# EasyEDA Pro project Access Control Signal Relay Switch.eprj

# Schematic V2.0.1 Schematic
Create Date: 2024-05-02; Page Name: Main Page.V2.0.V2.0.1 Signal Relay Schematic; Project Name: Access Control V2.1; Schematic Name: V2.0.1 Signal Relay Schematic; Update Date: 2024-05-22; Company: RIT SHED MAKERSPACE; Drawn: Jim Heaney; Page Size: A4; Part Number: N/A; Reviewed: Jim Heaney; Version: V2.1.0
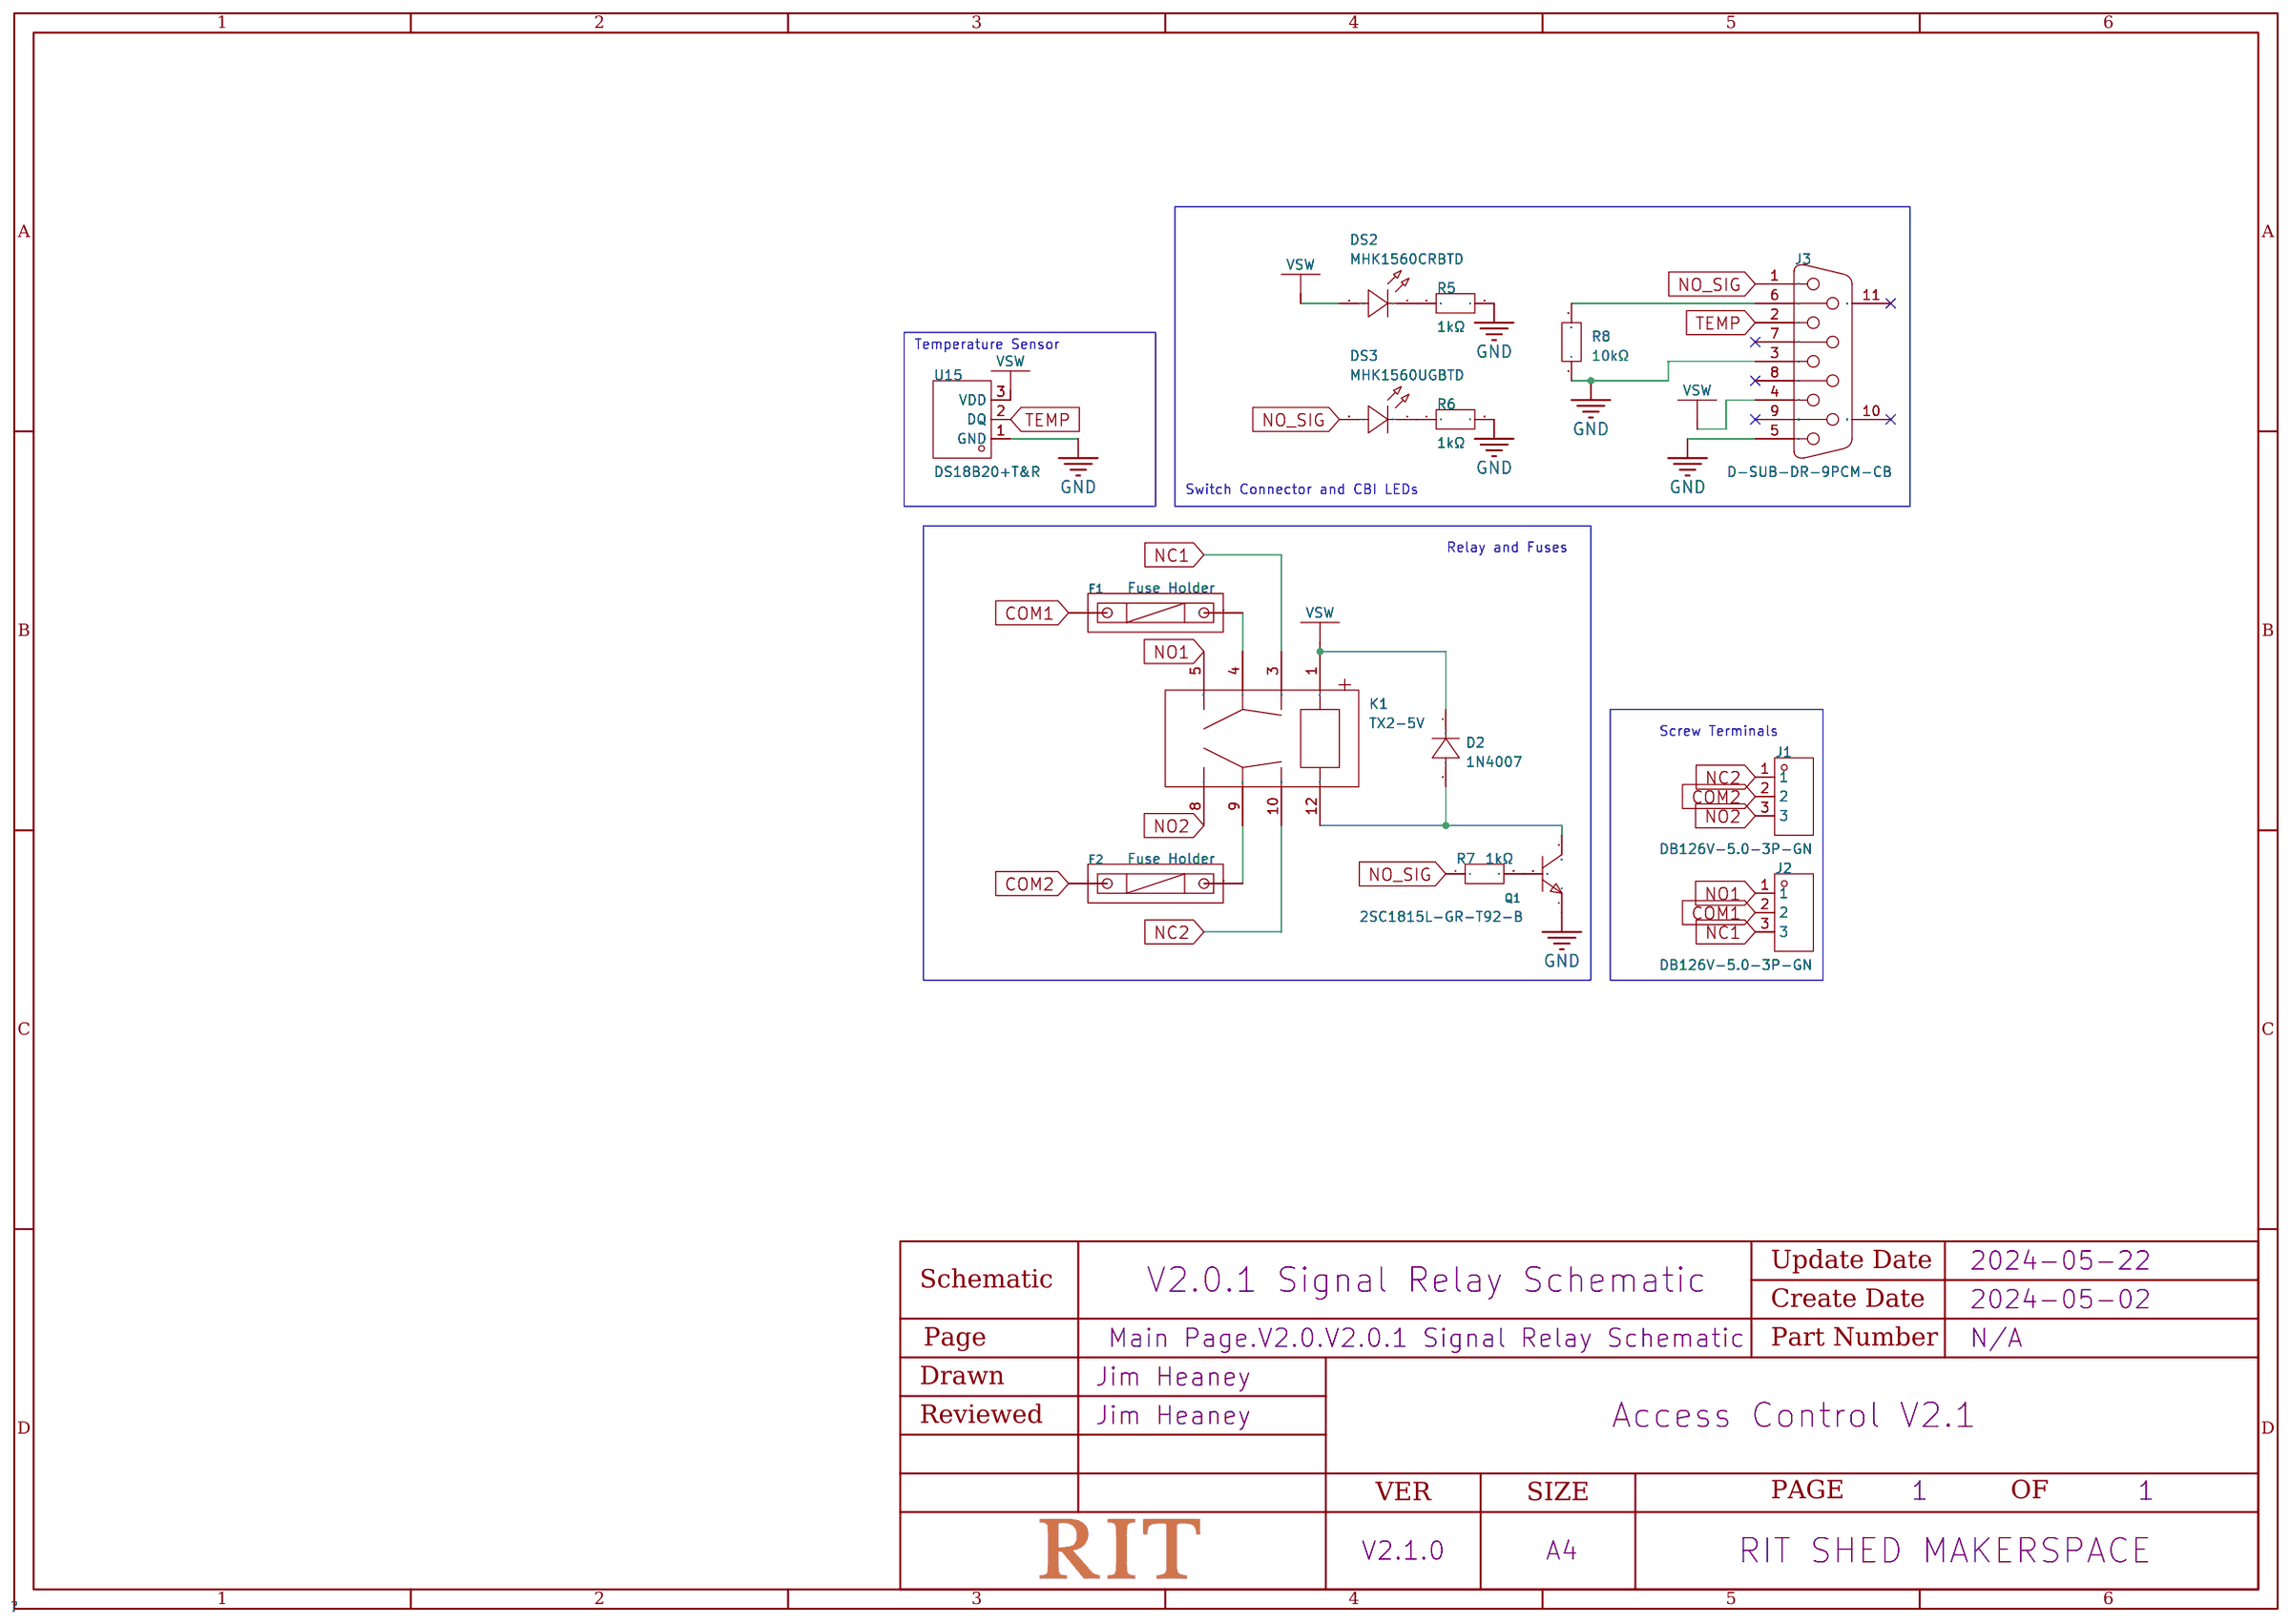
[diagram p0: schematic sheet]

## Parts
D2  1N4007  [DO-41_BD2.4-L4.7-P8.70-D0.8-RD]
DS2  MHK1560CRBTD  [LED-TH_MHK1560UGBTD]
DS3  MHK1560UGBTD  [LED-TH_MHK1560UGBTD]
F1  Fuse Holder  [FUSE-TH_L24.5-W9.8-P22.5]
F2  Fuse Holder  [FUSE-TH_L24.5-W9.8-P22.5]
J1  DB126V-5.0-3P-GN  [CONN-TH_3P-P5.00_DB126V-5.0-3P]
J2  DB126V-5.0-3P-GN  [CONN-TH_3P-P5.00_DB126V-5.0-3P]
J3  D-SUB-DR-9PCM-CB  [DB9-TH_ID09S33E4GV00LF]
K1  TX2-5V  [RELAY-TH_TX2-3V]
Q1  2SC1815L-GR-T92-B  [TO-92-3_L4.9-W3.7-P2.54-L]
R5  1kΩ  [RES-TH_BD2.3-L6.5-P10.50-D0.5]
R6  1kΩ  [RES-TH_BD2.3-L6.5-P10.50-D0.5]
R7  1kΩ  [RES-TH_BD2.3-L6.5-P10.50-D0.5]
R8  10kΩ  [RES-TH_BD2.7-L6.2-P10.20-D0.4]
U15  DS18B20+T&R  [TO-92-3_L4.9-W3.7-P2.54-L]

## Library data of the parts
D2 = 1N4007_C2985028: Forward Voltage (Vf@If):1V@1A Reverse Voltage (Vr): Average Rectified Current (Io):; LCSC Part Name: 电压:1kV 电流:1A; Supplier Part: C2985028; Manufacturer: GOODWORK(固得沃克); Supplier Footprint: DO-41; JLCPCB Part Class: Extended Part; Datasheet: https://atta.szlcsc.com/upload/public/pdf/source/20210723/C2848669_ECFE0BC1B34B7BAAA686846FF0F306A7.pdf; Supplier: LCSC; Forward Voltage (Vf@If): 1V@1A
DS2 = MHK1560CGBTD: 20mA 雾状红透镜 50mcd -40℃~+85℃ 632nm Red 85° 1.75V~2.2V Plugin,P=2.54mm Light Emitting Diodes (LED) ROHS; LCSC Part Name: 1560直插单灯翠绿色光; Supplier Part: C7470835; Manufacturer: MEIHUA(美华); Supplier Footprint: 插件,P=2.54mm; JLCPCB Part Class: Extended Part; Datasheet: https://atta.szlcsc.com/upload/public/pdf/source/20231114/0151DB1F997DCF286213A722D08B4BAA.pdf; Supplier: LCSC; Emitted Color: Emerald; Forward Voltage (VF): 1.75V~2.2V; Forward Current: 20mA; Dominant Wavelength: 520nm; Lens Color: 雾状绿透镜; Luminous Intensity: 1000mcd; Viewing Angle: 85°; Operating Temperature: -40℃~+85℃
DS3 = MHK1560UGBTD: Emitted Color:Emerald Forward Voltage (VF):1.75V~2.2V Forward Voltage (VF):1.75V~2.2V Forward Current:20mA Dominant Wavelength:520nm Dominant Wavelength:520nm Lens Color:雾状绿透镜 Luminous Intensity:1000mcd Luminous Intensity:1000mcd Viewing Angle:85° Operati; LCSC Part Name: 1560直插单灯翠绿色光; Supplier Part: C7470833; Manufacturer: MEIHUA(美华); Supplier Footprint: 插件,P=2.54mm; JLCPCB Part Class: Extended Part; Datasheet: https://atta.szlcsc.com/upload/public/pdf/source/20231114/0151DB1F997DCF286213A722D08B4BAA.pdf; Supplier: LCSC; Emitted Color: Emerald; Forward Voltage (VF): 1.75V~2.2V; Forward Current: 20mA; Dominant Wavelength: 520nm; Lens Color: 雾状绿透镜; Luminous Intensity: 1000mcd; Viewing Angle: 85°; Operating Temperature: -40℃~+85℃
F1 F2 = 保险丝透明座: Fuseholder Type:- Fuse Type:- Fuse Size:-; LCSC Part Name: 保险丝座 5*20 透明座(两件套); Supplier Part: C58066; Manufacturer: xcfuse(旭程); JLCPCB Part Class: Extended Part; Datasheet: https://atta.szlcsc.com/upload/public/pdf/source/20201109/C58066_EF84FEEE40948BE1BD26BCA72E4FE443.pdf; Supplier: LCSC
J1 J2 = DB126V-5.0-3P-GN_C395850: Structure:1x3P Pitch:5mm Color:Green Mounting Style:Straight Current Rating (Max):15A Voltage Rating (Max):250V Number of Pins:3P Number of Rows:1 Wire Gauge - AWG:14~26 Wire Gauge - AWG:14~26 Wire Gauge - mm2:1.5 Wire Gauge - mm2:1.5 Number of PINs Per R; LCSC Part Name: 5mm 1x3P 排数:1 每排P数:3 直插; Supplier Part: C395850; Manufacturer: DORABO(地博电气); Supplier Footprint: 插件,P=5mm; JLCPCB Part Class: Extended Part; Datasheet: https://atta.szlcsc.com/upload/public/pdf/source/20190923/C430579_AF9BA03CE2C1D84969AE00515C7DEF19.pdf; Supplier: LCSC; Structure: 1x3P; Pitch: 5mm; Color: Green; Mounting Style: Straight; Current Rating (Max): 15A; Voltage Rating (Max): 250V; Number of Pins: 3P; Number of Rows: 1; Wire Gauge - AWG: 14~26; Wire Gauge - mm2: 1.5; Number of PINs Per Row: 3; Operating Temperature Range: -40℃~+105℃
J3 = D-SUB-DR-9PCM-CB: Connector Type:D-Sub Gender:Female Number of Pins:9P Mounting Style:Right-Angle Number of Rows:2 Current Rating (Max):3A Contact Plating:Tin Operating Temperature Range:-50℃~+105℃ Operating Temperature Range:-50℃~+105℃; LCSC Part Name: D-Sub 母 P数:9P; Supplier Part: C19077337; Manufacturer: XUNPU(讯普); Supplier Footprint: 弯插; JLCPCB Part Class: Extended Part; Datasheet: https://atta.szlcsc.com/upload/public/pdf/source/20231108/FB2E8AB0BE4F620DDF3F7F4D0B9AFB97.pdf; Supplier: LCSC; Connector Type: D-Sub; Gender: Female; Number of Pins: 9P; Mounting Style: Right-Angle; Number of Rows: 2; Current Rating (Max): 3A; Contact Plating: Tin; Operating Temperature Range: -50℃~+105℃
K1 = TX2-5V: Coil Voltage:5V Contact Form:两组转换:2C(DPDT-转换) Pin Number:- Contact Rating:- Maximum Switching Voltage:220V@DC Contact Material:silver+Gold plating Coil Resistance:- Maximum Switching Current:2A Operate Time:4ms Release Time:4ms Coil Type:- Contact Resista; Supplier Part: C192257; Manufacturer: PANASONIC(松下); Supplier Footprint: DIP,7.4x15mm; JLCPCB Part Class: Extended Part; Datasheet: https://atta.szlcsc.com/upload/public/pdf/source/20180524/C192257_90ABE86BE073F309F1A3B364AFE43747.pdf; Supplier: LCSC; Coil Voltage: 5V; Contact Form: 两组转换:2C(DPDT-转换); Maximum Switching Voltage: 220V@DC; Contact Material: silver+Gold plating; Maximum Switching Current: 2A; Operate Time: 4ms; Release Time: 4ms; Operating Temperature: -40℃~+85℃
Q1 = 2SC1815L-GR-T92-B: Transistor Type: Collector Current (Ic): Collector-Emitter Breakdown Voltage (Vceo): Power Dissipation (Pd):; LCSC Part Name: 耐压:50V 电流:150mA NPN hfe=200~400; Supplier Part: C73309; Manufacturer: UTC(友顺); Supplier Footprint: TO-92-2.54mm; JLCPCB Part Class: Extended Part; Datasheet: https://atta.szlcsc.com/upload/public/pdf/source/20170209/1486607344255.pdf; Supplier: LCSC
R5-R7 = MF1/4W-1KΩ±1%T52: Type:Metal Film Resistors Resistance: Tolerance:±1% Tolerance:±1% Power(Watts):250mW Temperature Coefficient:±200ppm/℃ Temperature Coefficient:±200ppm/℃; LCSC Part Name: 金属膜电阻 1kΩ ±1% 250mW; Supplier Part: C713997; Manufacturer: 华星机电; Supplier Footprint: 插件,D2.3xL6.5mm; JLCPCB Part Class: Extended Part; Datasheet: https://atta.szlcsc.com/upload/public/pdf/source/20200731/C713882_AE8EB1102749D7E4FB4FB13DC898C429.pdf; Supplier: LCSC; Type: Metal Film Resistors; Tolerance: ±1%; Power(Watts): 250mW; Temperature Coefficient: ±200ppm/℃
R8 = CR1/4W-10K±5%-ST26: Type:Carbon Resister Resistance: Tolerance:±5% Tolerance:±5% Overload Voltage (Max):250V Power(Watts):250mW Temperature Coefficient:±350ppm/℃ Temperature Coefficient:±350ppm/℃ Operating Temperature Range:-55℃~+155℃ Operating Temperature Range:-55℃~+155℃; LCSC Part Name: 碳膜电阻 10kΩ ±5% 250mW; Supplier Part: C2894599; Manufacturer: VO(翔胜); Supplier Footprint: 插件,2.7x6.2mm; JLCPCB Part Class: Extended Part; Datasheet: https://atta.szlcsc.com/upload/public/pdf/source/20210803/C2857407_45FF53FE186CAB545115AD37303966CD.pdf; Supplier: LCSC; Type: Carbon Resister; Tolerance: ±5%; Overload Voltage (Max): 250V; Power(Watts): 250mW; Temperature Coefficient: ±350ppm/℃; Operating Temperature Range: -55℃~+155℃
U15 = DS18B20+T&R: Supply Voltage:3V~5.5V Supply Voltage:3V~5.5V; Supplier Part: C880672; Manufacturer: ADI(亚德诺)/MAXIM(美信); Supplier Footprint: TO-92; JLCPCB Part Class: Extended Part; Datasheet: https://atta.szlcsc.com/upload/public/pdf/source/20201223/C880672_EEBB787AABBE3FE11FE7BE07B2E2EC5E.pdf; Supplier: LCSC; Supply Voltage: 3V~5.5V

## Nets
GND: J3.3 J3.5 Q1.1(E) R5.2 R6.2 R8.1 U15.1(GND)
COM1: F1.1 J2.2
COM2: F2.1 J1.2
NC1: J2.3 K1.3
NC2: J1.1 K1.10
NO1: J2.1 K1.5
NO2: J1.3 K1.8
NO_SIG: DS3.2(A) J3.1 R7.1
TEMP: J3.2 U15.2(DQ)
VSW: D2.1(K) DS2.2(A) J3.4 K1.1 U15.3(VDD)
$1N839: D2.2(A) K1.12 Q1.2(C)
$1N884: F1.2 K1.4
$1N893: F2.2 K1.9
$1N3609: DS2.1(K) R5.1
$1N3632: DS3.1(K) R6.1
$1N3675: Q1.3(B) R7.2
$1N4107: J3.6 R8.2

Not connected (* = marked no-connect by the designer): J3 7* 8* 9* 10(MH1)* 11(MH2)*

## Notes on the sheet
- Temperature Sensor
- Switch Connector and CBI LEDs
- Relay and Fuses
- Screw Terminals

# Board V2.0.1 PCB
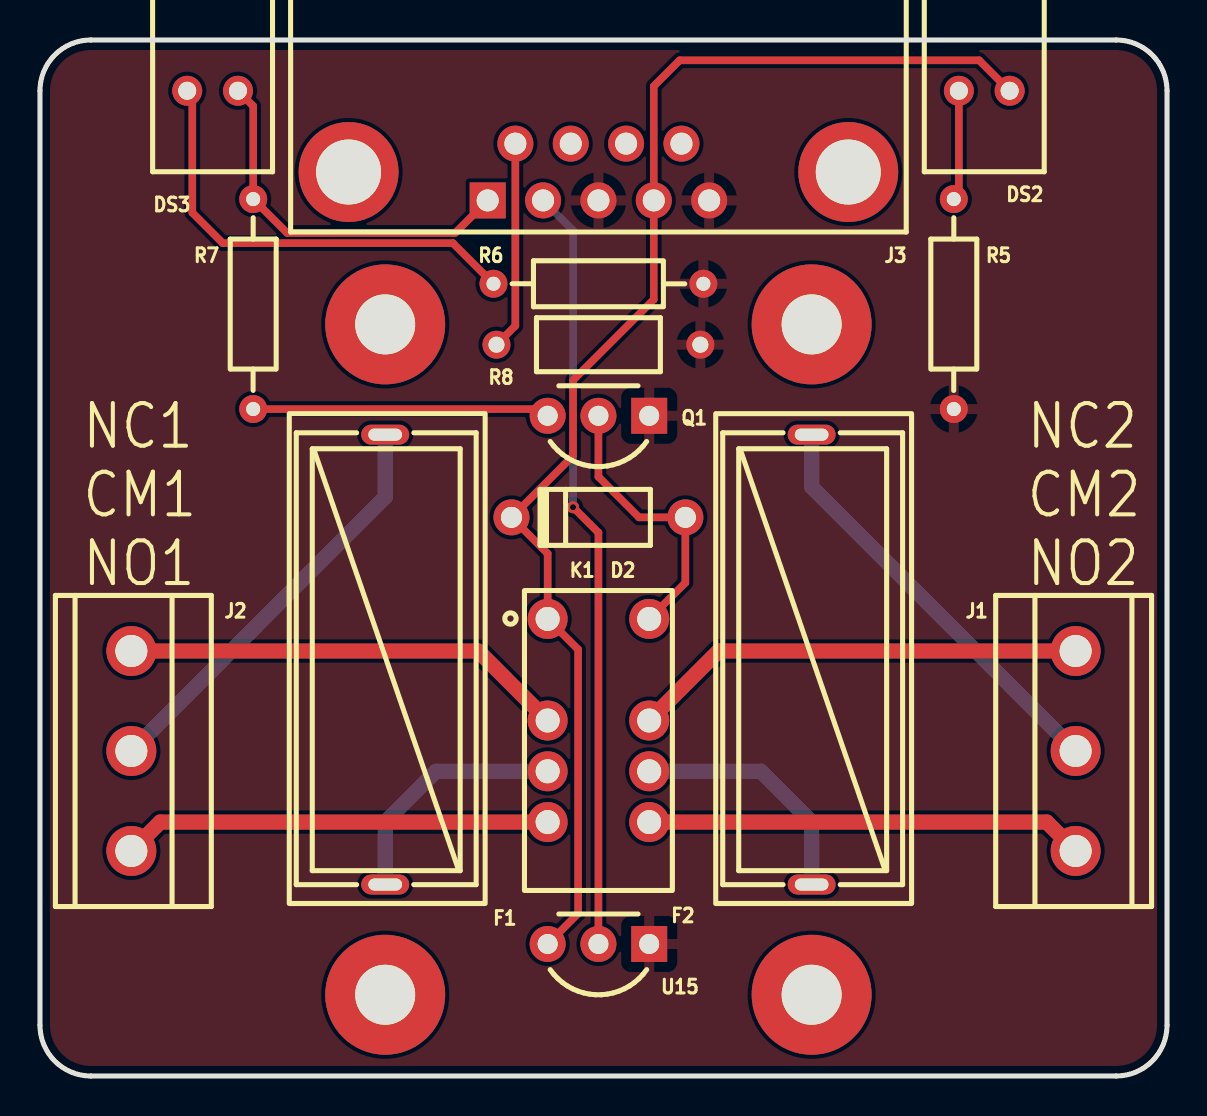
[diagram p1: board, top side]
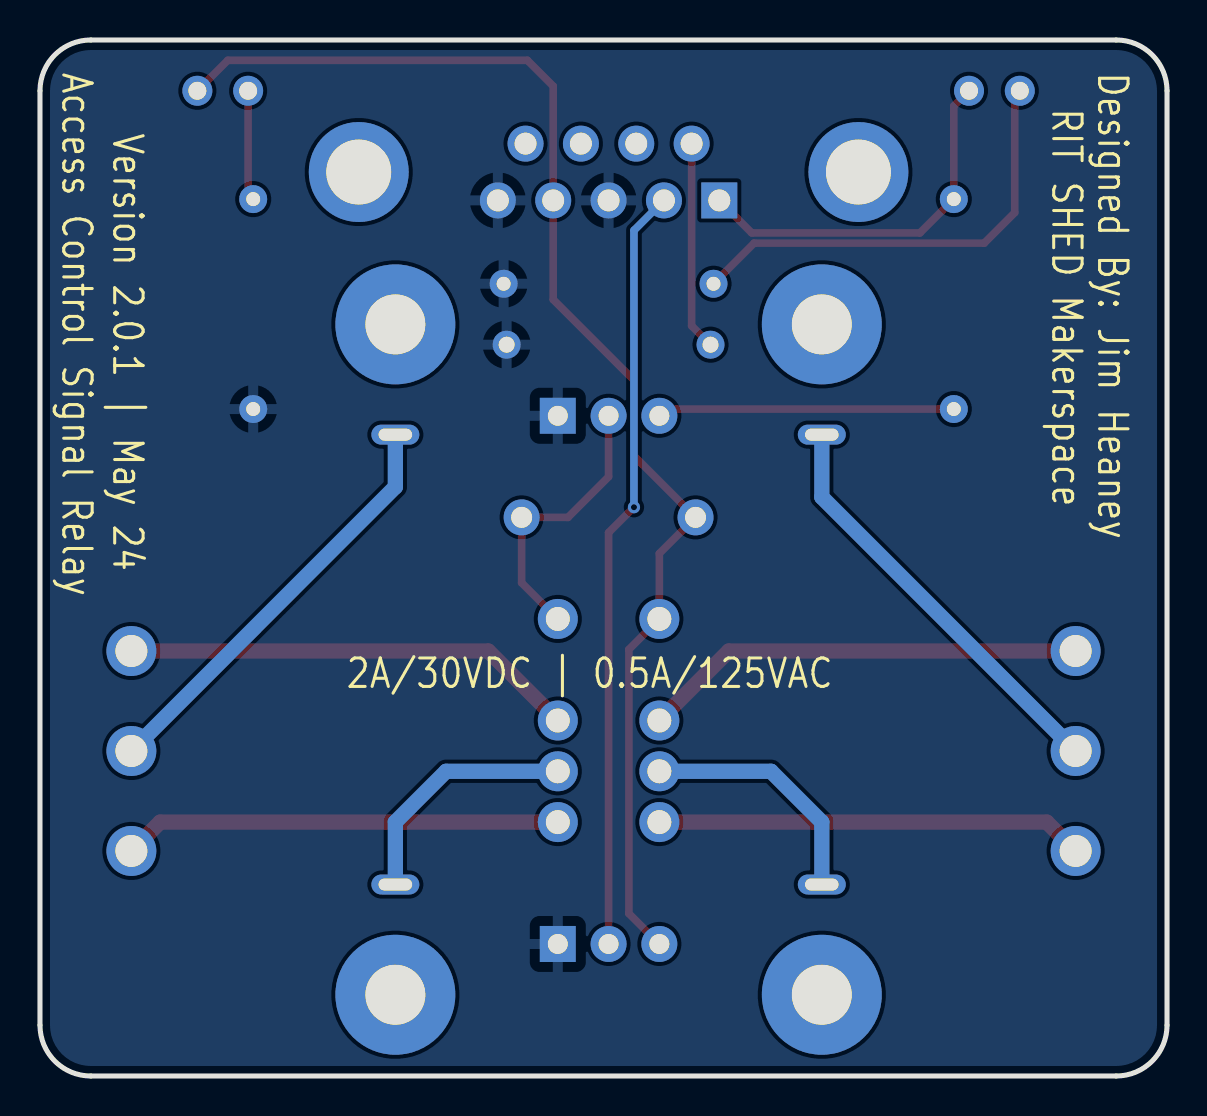
[diagram p2: board, bottom side, seen from below]

Outline 56.39 x 51.82 mm; copper layers: Top Layer, Bottom Layer. Coordinates in mm from the lower left corner of the outline.
Outline path: 0,49.28 0,2.54 arc(0.74,0.74) 2.54,0 53.85,0 arc(55.64,0.74) 56.39,2.54 56.39,49.28 arc(55.64,51.07) 53.85,51.82 2.54,51.82 arc(0.74,51.07) 0,49.28
Stack: Top Layer 0.035mm / Dielectric1 1.51mm FR4 er 4.5 / Bottom Layer 0.035mm

## Design rules (mm)
template: JLCPCB Capability(Two Layers Board)
spacing copperThickness1oz (default): track to track 0.102, other pairs 0.152 to 0.3
spacing copperThickness2oz: track to track 0.203, other pairs 0.152 to 0.3
track width copperThickness1oz (default): min 0.127, default 0.254, max 2.54
track width copperThickness2oz: min 0.203, default 0.254, max 2.54
differential pair differentialPair (default): width min 0.127, default 0.254, max 2.54; gap min 0.152, default 0.152
via viaSize (default): diameter min 0.5, default 0.61, max 10; hole min 0.3, default 0.305, max 6.3

## Placement (name value [footprint] x y rotation side)
D2  1N4007  [DO-41_BD2.4-L4.7-P8.70-D0.8-RD]  27.94 27.94 0 top
DS2  MHK1560CRBTD  [LED-TH_MHK1560UGBTD]  47.24 49.28 180 top
DS3  MHK1560UGBTD  [LED-TH_MHK1560UGBTD]  8.64 49.28 180 top
F1  Fuse Holder  [FUSE-TH_L24.5-W9.8-P22.5]  17.27 20.83 270 top
F2  Fuse Holder  [FUSE-TH_L24.5-W9.8-P22.5]  38.61 20.83 270 top
J1  DB126V-5.0-3P-GN  [CONN-TH_3P-P5.00_DB126V-5.0-3P]  51.82 16.26 270 top
J2  DB126V-5.0-3P-GN  [CONN-TH_3P-P5.00_DB126V-5.0-3P]  4.57 16.26 90 top
J3  D-SUB-DR-9PCM-CB  [DB9-TH_ID09S33E4GV00LF]  27.94 45.21 180 top
K1  TX2-5V  [RELAY-TH_TX2-3V]  27.94 17.78 270 top
NOREF  -  [Pad_e95]  17.27 4.06 0 top
NOREF#2  -  [Pad_e96]  38.61 37.59 0 top
NOREF#3  -  [Pad_e115]  38.61 4.06 0 top
NOREF#4  -  [Pad_e94]  17.27 37.59 0 top
Q1  2SC1815L-GR-T92-B  [TO-92-3_L4.9-W3.7-P2.54-L]  27.94 33.02 180 top
R5  1kΩ  [RES-TH_BD2.3-L6.5-P10.50-D0.5]  45.72 38.61 270 top
R6  1kΩ  [RES-TH_BD2.3-L6.5-P10.50-D0.5]  27.94 39.62 0 top
R7  1kΩ  [RES-TH_BD2.3-L6.5-P10.50-D0.5]  10.67 38.61 270 top
R8  10kΩ  [RES-TH_BD2.7-L6.2-P10.20-D0.4]  27.94 36.58 180 top
U15  DS18B20+T&R  [TO-92-3_L4.9-W3.7-P2.54-L]  27.94 6.6 180 top

## Footprints (pads in the part's own frame, mm; a bottom-side part is the same pattern mirrored in y, then rotated)
CONN-TH_3P-P5.00_DB126V-5.0-3P
  round 2.5 hole 1.6: 1(-5,0) 2(0,0) 3(5,0)
DB9-TH_ID09S33E4GV00LF
  rect 1.8x1.8 hole 1.1: 1(5.54,1.42)
  round 1.8 hole 1.1: 2(2.77,1.42) 3(0,1.42) 4(-2.77,1.42) 5(-5.54,1.42) 6(4.155,-1.42) 7(1.385,-1.42) 8(-1.385,-1.42) 9(-4.155,-1.42)
  round 5 hole 3.25: 10(-12.5,0) 11(12.5,0)
DO-41_BD2.4-L4.7-P8.70-D0.8-RD
  round 1.8 hole 1.05: 1(-4.35,0) 2(4.35,0)
FUSE-TH_L24.5-W9.8-P22.5
  oval 1x2.4 hole 0.6x1.68: 1(-11.25,0) 2(11.25,0)
LED-TH_MHK1560UGBTD
  round 1.5 hole 0.9: 1(1.27,0) 2(-1.27,0)
Pad_e94
  round 6 hole 3: 7(0,0)
Pad_e95
  round 6 hole 3: 7(0,0)
Pad_e96
  round 6 hole 3: 7(0,0)
Pad_e115
  round 6 hole 3: 7(0,0)
RELAY-TH_TX2-3V
  round 2 hole 1.2: 1(-5.08,-2.54) 3(0,-2.54) 4(2.54,-2.54) 5(5.08,-2.54) 8(5.08,2.54) 9(2.54,2.54) 10(0,2.54) 12(-5.08,2.54)
RES-TH_BD2.3-L6.5-P10.50-D0.5
  round 1.4 hole 0.7: 1(-5.25,0) 2(5.25,0)
RES-TH_BD2.7-L6.2-P10.20-D0.4
  round 1.4 hole 0.8: 1(-5.1,0) 2(5.1,0)
TO-92-3_L4.9-W3.7-P2.54-L
  rect 1.8x1.8 hole 1: 1(-2.54,0)
  round 1.8 hole 1: 2(0,0) 3(2.54,0)

## Nets
As in the schematic.

Pads without a net: J3 7 8 9 10 11; NOREF 7; NOREF#2 7; NOREF#3 7; NOREF#4 7

## Via types
v1: diameter 0.61, hole 0.305, Top Layer to Bottom Layer, 1 via

## Routing (per net, layer and track width the routed paths; a pad name or vN(x,y) marks a point on that pad's centre or on a via; arc(x,y) is an arc through that point)
COM1: length 21.1
  Bottom Layer w0.762: F1.1 17.27,28.96 J2.2
COM2: length 21.3
  Bottom Layer w0.762: J1.2 38.61,29.46 F2.1
NC1: length 22.3
  Top Layer w0.762: K1.3 21.92,21.26 J2.3
NC2: length 22.8
  Top Layer w0.762: J1.1 33.96,21.26 K1.10
NO1: length 21.4
  Top Layer w0.762: J2.1 6.02,12.7 K1.5
NO2: length 21.9
  Top Layer w0.762: K1.8 50.37,12.7 J1.3
NO_SIG: length 18.8
  Top Layer w0.381: J3.1 20.77,42.16 12.36,42.16 R7.1 10.67,48.51 DS3.2
TEMP: length 38.3
  Top Layer w0.381: U15.2 27.94,27.18 v1(26.67,28.45)
  Bottom Layer w0.381: v1(26.67,28.45) 26.67,42.29 J3.2
VSW: length 66.8
  Top Layer w0.381: DS2.2 46.99,50.8 32,50.8 30.71,49.51 J3.4 30.71,38.84 26.67,34.8 26.67,31.02 D2.1 25.4,26.13 K1.1 26.92,21.34 26.92,8.13 U15.3
$1N839: length 14.1
  Top Layer w0.381: K1.12 32.29,24.67 D2.2 29.97,27.94 27.94,29.97 Q1.2
$1N884: length 12.3
  Bottom Layer w0.762: F1.2 17.27,12.7 19.81,15.24 K1.4
$1N893: length 12.3
  Bottom Layer w0.762: K1.9 36.07,15.24 38.61,12.7 F2.2
$1N3609: length 5.5
  Top Layer w0.381: DS2.1 45.97,44.11 R5.1
$1N3632: length 22.7
  Top Layer w0.381: R6.1 20.66,41.66 9.14,41.66 7.62,43.18 7.62,49.02 DS3.1
$1N3675: length 14.9
  Top Layer w0.381: R7.2 25.06,33.36 Q1.3
$1N4107: length 10.4
  Top Layer w0.381: R8.2 23.78,37.52 J3.6

## Copper pours and planes (outline as drawn; the poured copper is in the pictures)
GND on Top Layer: 0,55.37 56.39,55.37 56.39,-7.11 0,-7.11
GND on Bottom Layer: -1.02,52.83 57.4,52.83 57.4,-2.54 -1.02,-2.54

## Text on the board
Bottom Silkscreen Layer: 2A/30VDC | 0.5A/125VAC | Designed By: Jim Heaney | RIT SHED Makerspace | Version 2.0.1 | May 24 | Access Control Signal Relay
Top Silkscreen Layer: NC1 / CM1 / NO1 | NC2 / CM2 / NO2
